# EAGLE design PanTiltHeader (EAGLE 9.6.2)
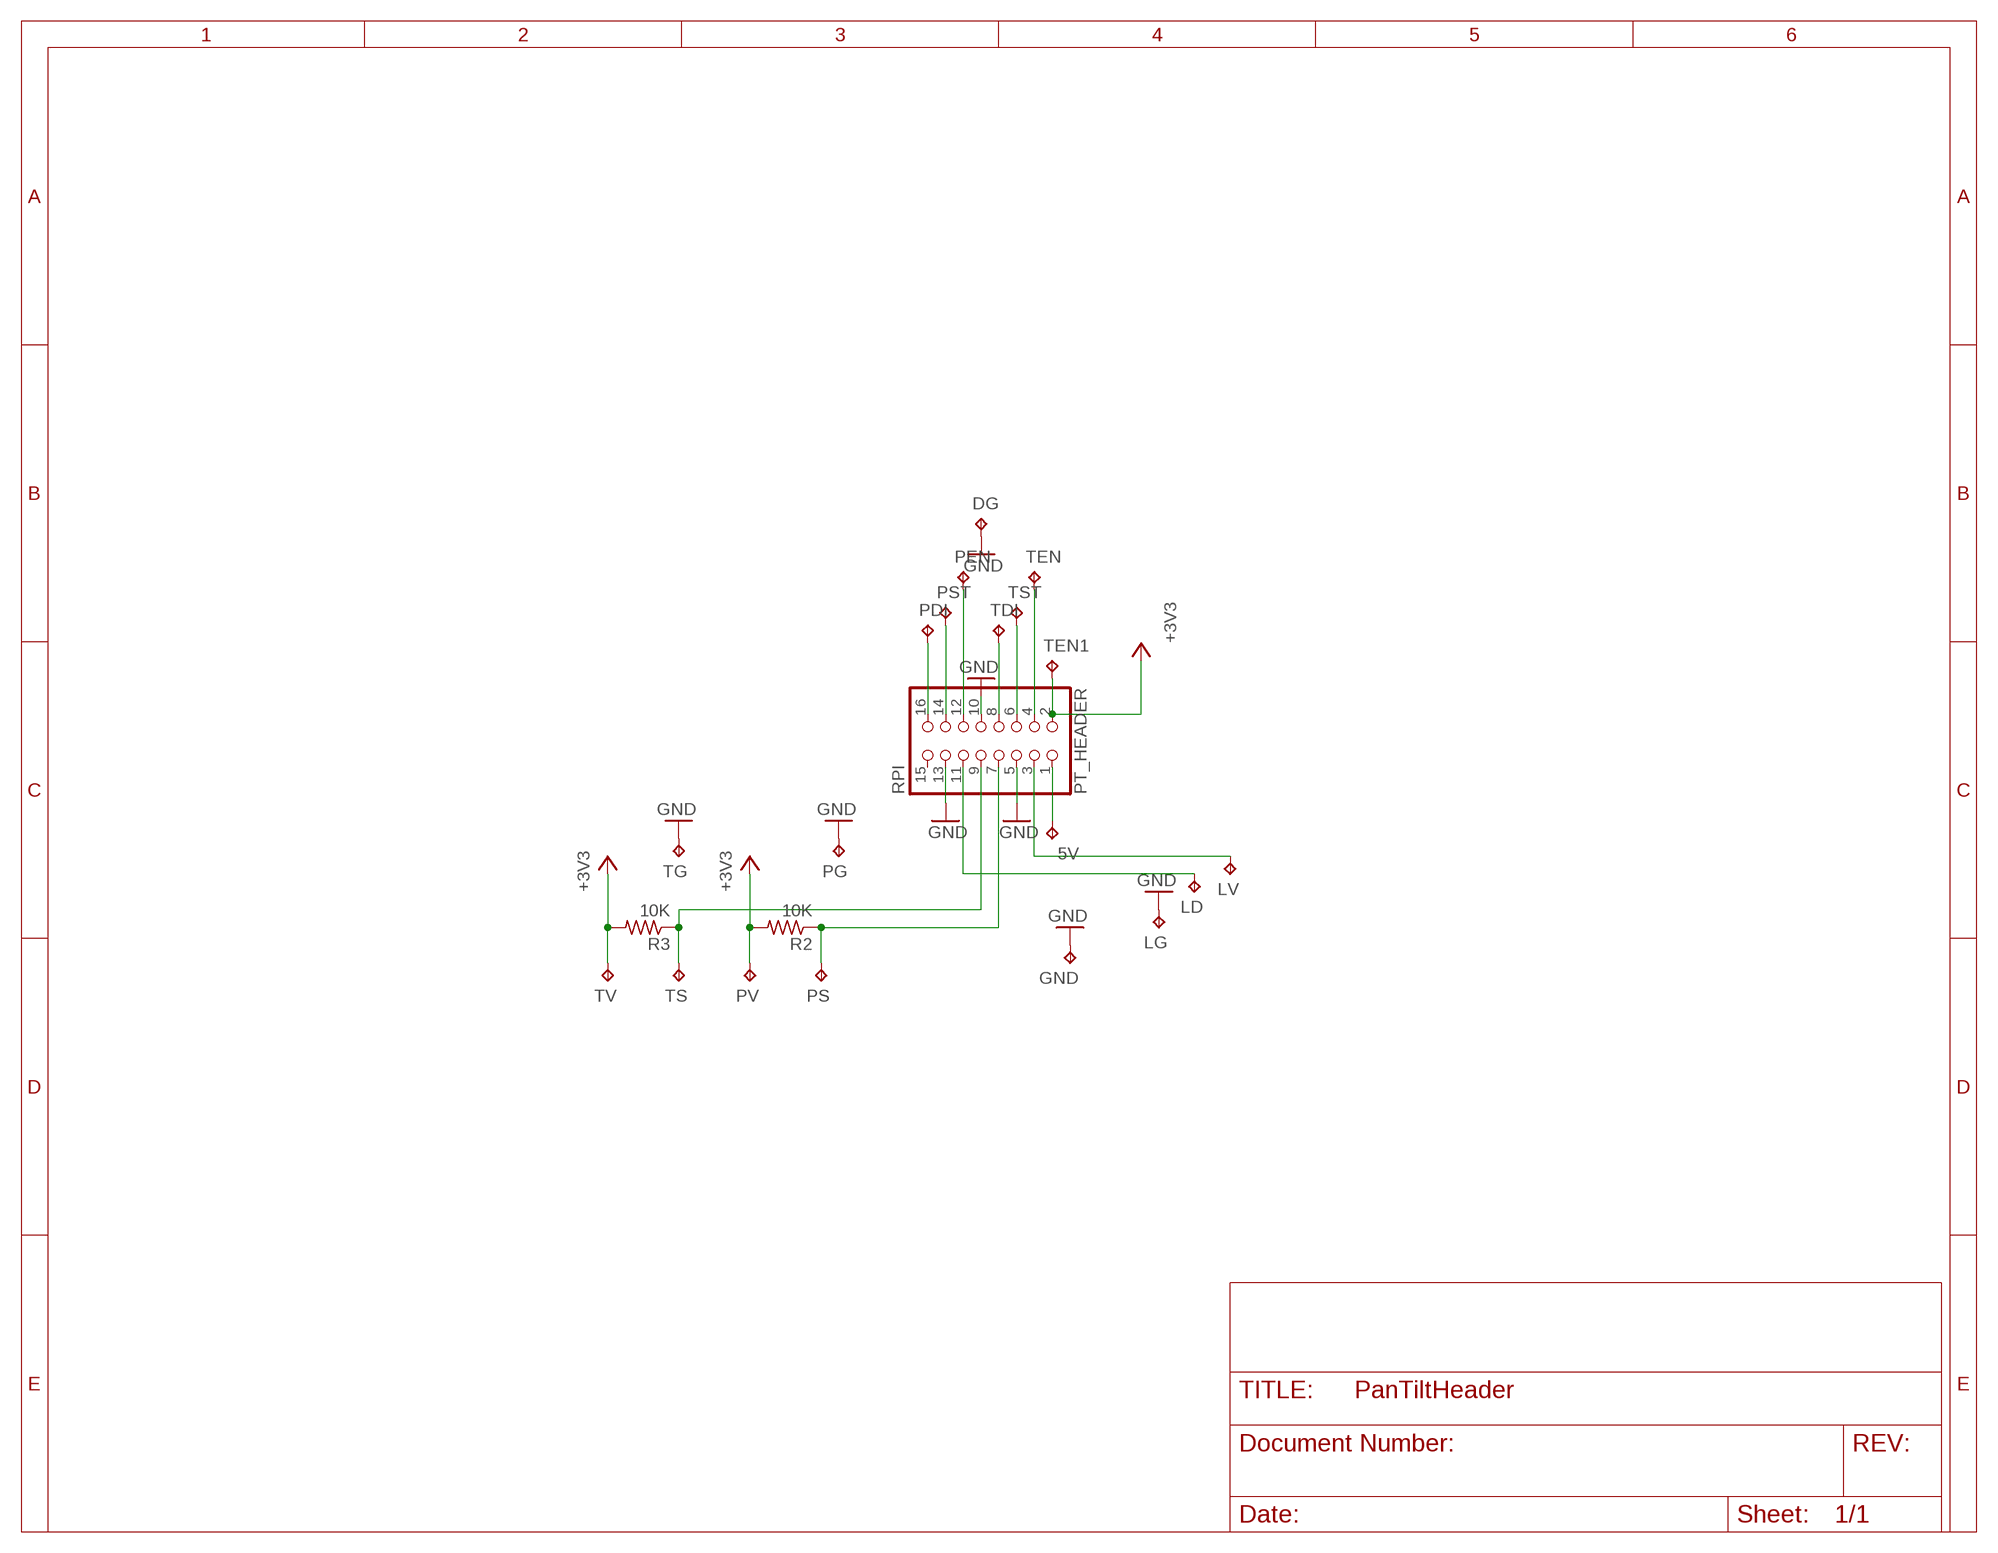
[diagram p0: schematic, sheet 1]

## Parts
5V  TPPAD1-13Y  [P1-13Y]
DG  TPPAD1-13Y  [P1-13Y]
GND  TPPAD1-13Y  [P1-13Y]
LD  TPPAD1-13Y  [P1-13Y]
LG  TPPAD1-13Y  [P1-13Y]
LV  TPPAD1-13Y  [P1-13Y]
PDI  TPPAD1-13Y  [P1-13Y]
PEN  TPPAD1-13Y  [P1-13Y]
PG  TPPAD1-13Y  [P1-13Y]
PS  TPPAD1-13Y  [P1-13Y]
PST  TPPAD1-13Y  [P1-13Y]
PT_HEADER  RPI  PINHD-2X8  [2X08]
PV  TPPAD1-13Y  [P1-13Y]
R2  10K  R-US_0204/7  [0204/7]
R3  10K  R-US_0204/7  [0204/7]
TDI  TPPAD1-13Y  [P1-13Y]
TEN  TPPAD1-13Y  [P1-13Y]
TEN1  TPPAD1-13Y  [P1-13Y]
TG  TPPAD1-13Y  [P1-13Y]
TS  TPPAD1-13Y  [P1-13Y]
TST  TPPAD1-13Y  [P1-13Y]
TV  TPPAD1-13Y  [P1-13Y]

## Nets
+3V3: PT_HEADER.2 PV.TP R2.2 R3.2 TEN1.TP TV.TP
GND: DG.TP GND.TP LG.TP PG.TP PT_HEADER.5 PT_HEADER.10 PT_HEADER.13 TG.TP
N$2: PT_HEADER.4 TEN.TP
N$3: PT_HEADER.6 TST.TP
N$4: PT_HEADER.8 TDI.TP
N$5: PT_HEADER.9 R3.1 TS.TP
N$6: PEN.TP PT_HEADER.12
N$7: PST.TP PT_HEADER.14
N$8: PDI.TP PT_HEADER.16
N$9: 5V.TP PT_HEADER.1
N$10: LV.TP PT_HEADER.3
N$11: PS.TP PT_HEADER.7 R2.1
N$14: LD.TP PT_HEADER.11
Unconnected: PT_HEADER.15

## Library data of the parts
5V DG GND LD LG LV PDI PEN PG PS PST PV TDI TEN TEN1 TG TS TST TV = testpad:TP: Test pad
PT_HEADER = pinhead:PINHD-2X8: PIN HEADER
R2 R3 = rcl:R-US_: RESISTOR, American symbol; SPICEPREFIX: R

## Board
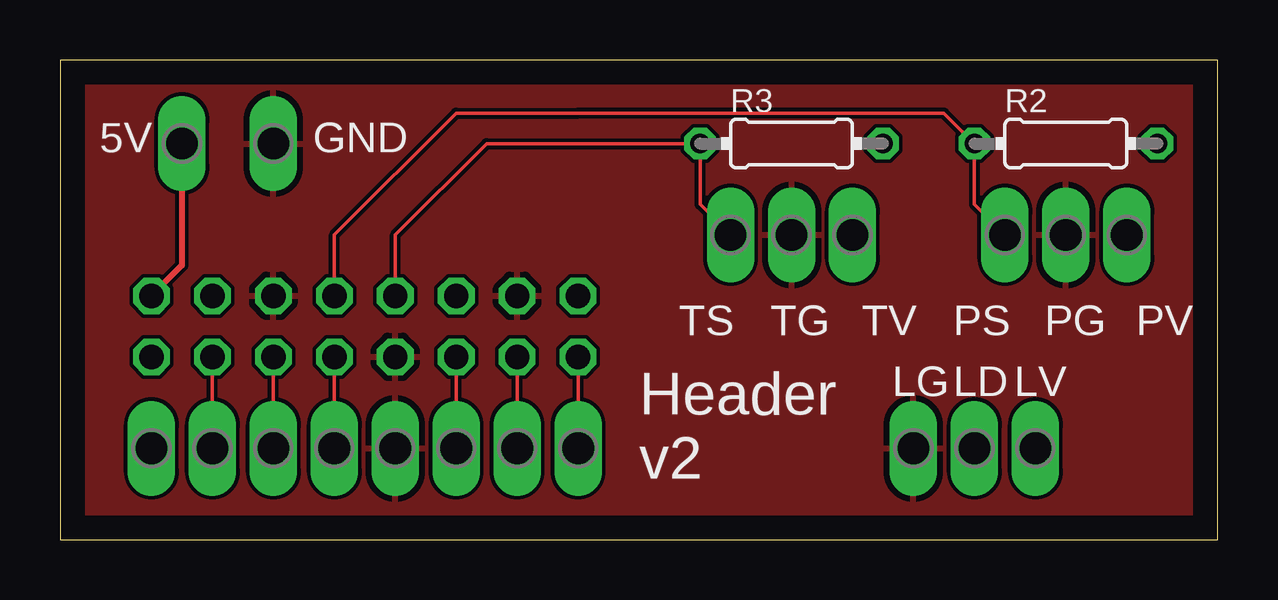
[diagram p1: board, top side]
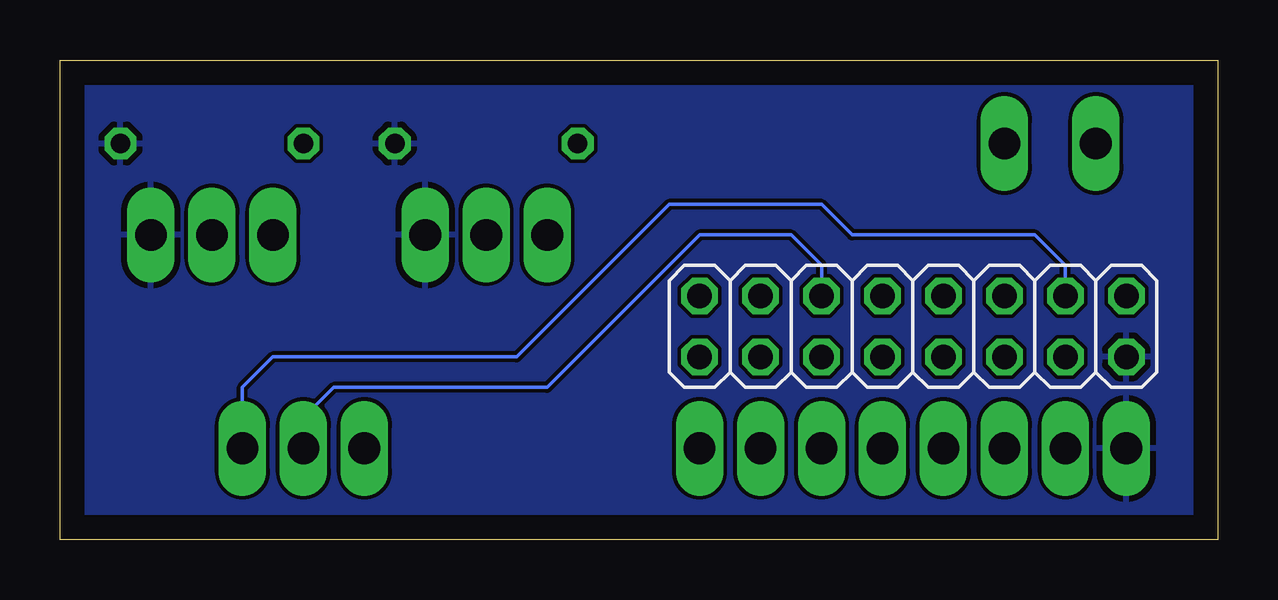
[diagram p2: board, bottom side, seen from below]

Size 48.24 x 19.99 mm. Coordinates in mm from the lower left corner, seen from the top.
Outline: 0,0 48.24,0 48.24,19.99 0,19.99 0,0
Copper layers (1*16): Top 0.035mm / dielectric 1.5mm / Bottom 0.035mm
Design rules "default": minimum track width 6mil, minimum drill 0.35mm, track to track 6mil, track to pad 6mil, pad to pad 6mil, via to via 6mil, smd to smd 6mil, copper to edge 40mil, drill to drill 6mil, minimum pad ring 10mil, minimum via ring 8mil, stop-mask expansion 4mil, vias tented up to drill 0mil, thermal gap 10mil

### Footprints (pad centres in the part's own frame; a part is rotated, then mirrored left to right if it is on the bottom)
P1-13Y = drill 1.321 pad 1.905 long: TP 0,0
2X08 = drill 1.016 octagon: 1 -8.89,-1.27; 2 -8.89,1.27; 3 -6.35,-1.27; 4 -6.35,1.27; 5 -3.81,-1.27; 6 -3.81,1.27; 7 -1.27,-1.27; 8 -1.27,1.27; 9 1.27,-1.27; 10 1.27,1.27; 11 3.81,-1.27; 12 3.81,1.27; 13 6.35,-1.27; 14 6.35,1.27; 15 8.89,-1.27; 16 8.89,1.27
0204/7 = drill 0.813 octagon: 1 -3.81,0; 2 3.81,0

### Placement (x,y rotation side)
5V  5.08,16.51 0 top
DG  13.97,3.81 0 top
GND  8.89,16.51 0 top
LD  38.1,3.81 0 top
LG  35.56,3.81 0 top
LV  40.64,3.81 0 top
PDI  21.59,3.81 0 top
PEN  16.51,3.81 0 top
PG  41.91,12.7 0 top
PS  39.37,12.7 0 top
PST  19.05,3.81 0 top
PT_HEADER  12.7,8.89 180 bottom
PV  44.45,12.7 0 top
R2  41.91,16.51 0 top
R3  30.48,16.51 0 top
TDI  11.43,3.81 0 top
TEN  6.35,3.81 0 top
TEN1  3.81,3.81 0 top
TG  30.48,12.7 0 top
TS  27.94,12.7 0 top
TST  8.89,3.81 0 top
TV  33.02,12.7 0 top

### Tracks (layer width: path | path; a pad name or v marks a point on that pad's centre or on a via)
+3V3
  pour Bottom: 0,0 48.26,0 48.26,20.32 0,20.32
GND
  pour Top: 0,0 48.26,0 48.26,20.32 0,20.32
N$2
  Top 0.152: TEN.TP PT_HEADER.4
N$3
  Top 0.152: TST.TP PT_HEADER.6
N$4
  Top 0.152: TDI.TP PT_HEADER.8
N$5
  Top 0.152: TS.TP 26.67,13.97 R3.1 17.78,16.51 13.97,12.7 PT_HEADER.9
N$6
  Top 0.152: PEN.TP PT_HEADER.12
N$7
  Top 0.152: PST.TP PT_HEADER.14
N$8
  Top 0.152: PDI.TP PT_HEADER.16
N$9
  Top 0.254: 5V.TP 5.08,11.43 PT_HEADER.1
N$10
  Bottom 0.152: PT_HEADER.3 6.35,11.43 7.62,12.7 15.24,12.7 16.51,13.97 22.86,13.97 29.21,7.62 39.37,7.62 40.64,6.35 40.64,4.12 LV.TP
N$11
  Top 0.152: PS.TP 38.1,13.97 R2.1 36.83,17.78 22.86,17.78 21.59,17.78 16.51,17.78 11.43,12.7 PT_HEADER.7
N$14
  Bottom 0.152: PT_HEADER.11 16.51,11.43 17.78,12.7 21.59,12.7 27.94,6.35 36.83,6.35 38.1,5.08 LD.TP

### Text on the board
tPlace: Header / v2